# Altium schematic sheet OX05B1S_CAM0.SchDoc: =ProjectTitle
size A3; SheetNumber: 15; SheetTotal: 19
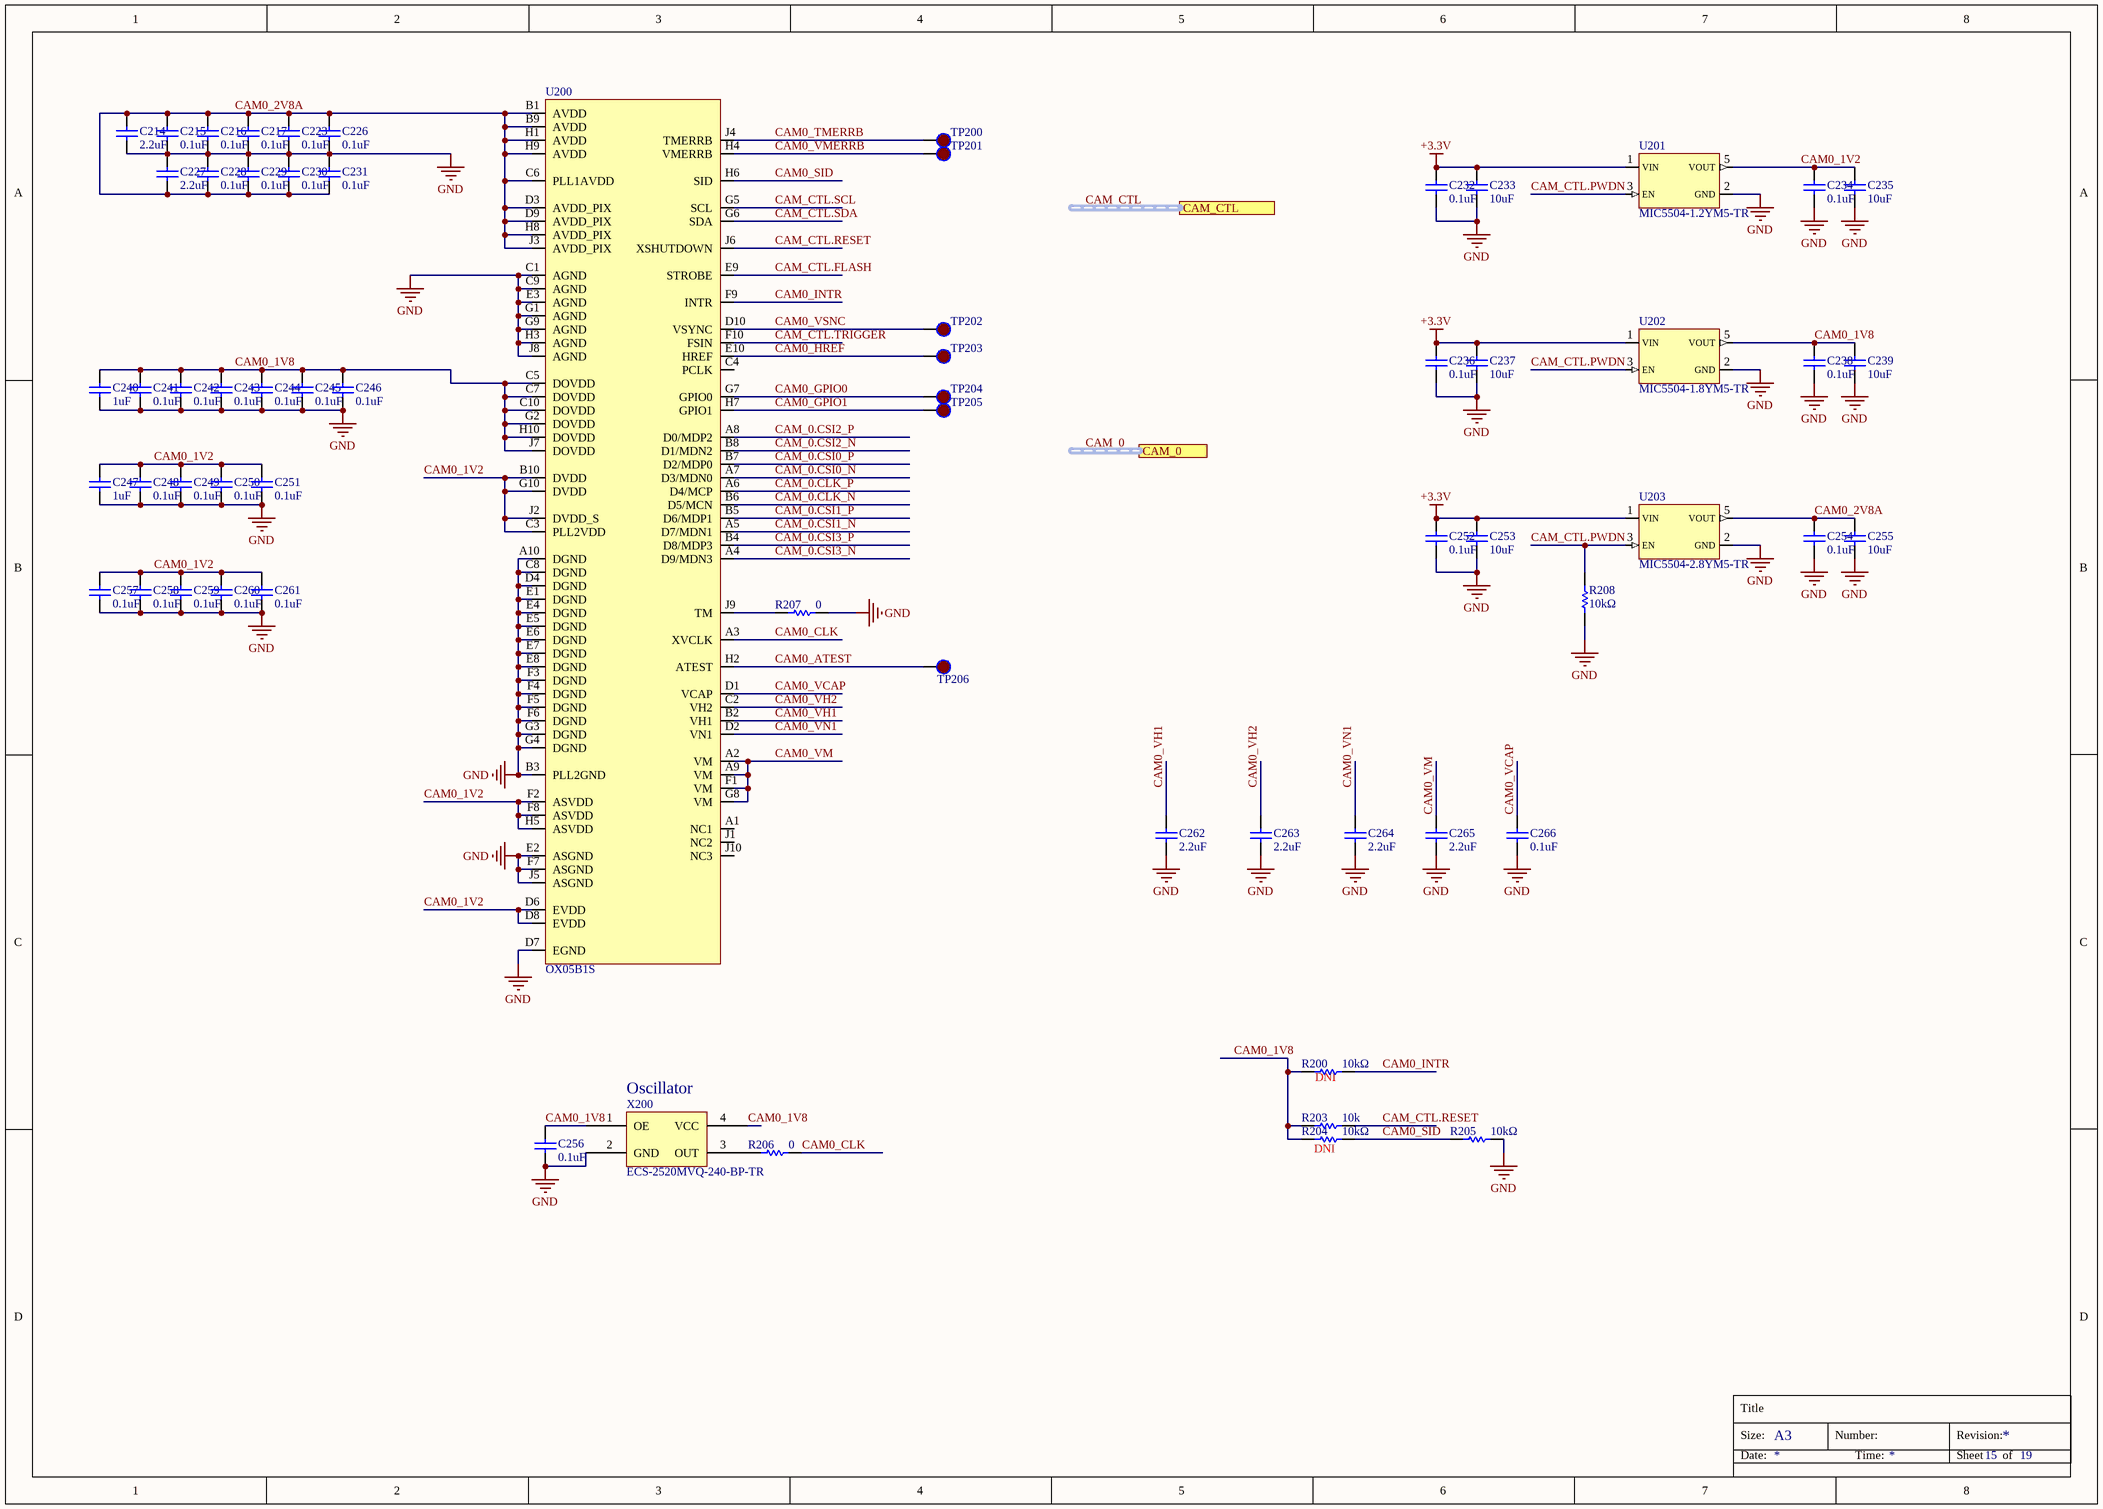
[diagram p0: OX05B1S_CAM0.SchDoc]

## Parts
C214  2.2uF  [0402_CAP_NP]
C215  0.1uF  [0402_CAP_NP]
C216  0.1uF  [0402_CAP_NP]
C217  0.1uF  [0402_CAP_NP]
C223  0.1uF  [0402_CAP_NP]
C226  0.1uF  [0402_CAP_NP]
C227  2.2uF  [0402_CAP_NP]
C228  0.1uF  [0402_CAP_NP]
C229  0.1uF  [0402_CAP_NP]
C230  0.1uF  [0402_CAP_NP]
C231  0.1uF  [0402_CAP_NP]
C232  0.1uF  [0402_CAP_NP]
C233  10uF  [0603_CAP_NP]
C234  0.1uF  [0402_CAP_NP]
C235  10uF  [0603_CAP_NP]
C236  0.1uF  [0402_CAP_NP]
C237  10uF  [0603_CAP_NP]
C238  0.1uF  [0402_CAP_NP]
C239  10uF  [0603_CAP_NP]
C240  1uF  [0402_CAP_NP]
C241  0.1uF  [0402_CAP_NP]
C242  0.1uF  [0402_CAP_NP]
C243  0.1uF  [0402_CAP_NP]
C244  0.1uF  [0402_CAP_NP]
C245  0.1uF  [0402_CAP_NP]
C246  0.1uF  [0402_CAP_NP]
C247  1uF  [0402_CAP_NP]
C248  0.1uF  [0402_CAP_NP]
C249  0.1uF  [0402_CAP_NP]
C250  0.1uF  [0402_CAP_NP]
C251  0.1uF  [0402_CAP_NP]
C252  0.1uF  [0402_CAP_NP]
C253  10uF  [0603_CAP_NP]
C254  0.1uF  [0402_CAP_NP]
C255  10uF  [0603_CAP_NP]
C256  0.1uF  [0402_CAP_NP]
C257  0.1uF  [0402_CAP_NP]
C258  0.1uF  [0402_CAP_NP]
C259  0.1uF  [0402_CAP_NP]
C260  0.1uF  [0402_CAP_NP]
C261  0.1uF  [0402_CAP_NP]
C262  2.2uF  [0402_CAP_NP]
C263  2.2uF  [0402_CAP_NP]
C264  2.2uF  [0402_CAP_NP]
C265  2.2uF  [0402_CAP_NP]
C266  0.1uF  [0402_CAP_NP]
R200  value 10kΩ  Populate: DNI  [0603_RES]  (hidden comment: 10k)
R203  10k  [0402_RES]
R204  value 10kΩ  Populate: DNI  [0603_RES]  (hidden comment: 10k)
R205  value 10kΩ  [0603_RES]  (hidden comment: 10k)
R206  0  [0603_RES]
R207  0  [0603_RES]
R208  value 10kΩ  [0603_RES]  (hidden comment: 10k)
TP200  TestPoint_1mm_SM  [TESTPAD_1mm]  (value not drawn)  (no BOM)
TP201  TestPoint_1mm_SM  [TESTPAD_1mm]  (value not drawn)  (no BOM)
TP202  TestPoint_1mm_SM  [TESTPAD_1mm]  (value not drawn)  (no BOM)
TP203  TestPoint_1mm_SM  [TESTPAD_1mm]  (value not drawn)  (no BOM)
TP204  TestPoint_1mm_SM  [TESTPAD_1mm]  (value not drawn)  (no BOM)
TP205  TestPoint_1mm_SM  [TESTPAD_1mm]  (value not drawn)  (no BOM)
TP206  TestPoint_1mm_SM  [TESTPIN_1mm]  (value not drawn)  (no BOM)
U200  OX05B1S  [BGA_OX05B1S]
U201  MIC5504-1.2YM5-TR  [SOT23-5]
U202  MIC5504-1.8YM5-TR  [SOT23-5]
U203  MIC5504-2.8YM5-TR  [SOT23-5]
X200  ECS-2520MVQ-240-BP-TR  [Active Oscillator 2520]

## Ports
CAM_0 (harness MIPI), CAM_CTL (harness CAM_CTL)

## Nets
+3.3V: C232.2 C233.2 C236.2 C237.2 C252.2 C253.2 U201.1(VIN) U202.1(VIN) U203.1(VIN)
GND: C214.1 C215.1 C216.1 C217.1 C223.1 C226.1 C227.2 C228.2 C229.2 C230.2 C231.2 C232.1 C233.1 C234.1 C235.1 C236.1 C237.1 C238.1 C239.1 C240.1 C241.1 C242.1 C243.1 C244.1 C245.1 C246.1 C247.1 C248.1 C249.1 C250.1 C251.1 C252.1 C253.1 C254.1 C255.1 C256.1 C257.1 C258.1 C259.1 C260.1 C261.1 C262.1 C263.1 C264.1 C265.1 C266.1 R205.1 R207.2 R208.2 U200.A10(DGND) U200.B3(PLL2GND) U200.C1(AGND) U200.C8(DGND) U200.C9(AGND) U200.D4(DGND) U200.D7(EGND) U200.E1(DGND) U200.E2(ASGND) U200.E3(AGND) U200.E4(DGND) U200.E5(DGND) U200.E6(DGND) U200.E7(DGND) U200.E8(DGND) U200.F3(DGND) U200.F4(DGND) U200.F5(DGND) U200.F6(DGND) U200.F7(ASGND) U200.G1(AGND) U200.G3(DGND) U200.G4(DGND) U200.G9(AGND) U200.H3(AGND) U200.J5(ASGND) U200.J8(AGND) U201.2(GND) U202.2(GND) U203.2(GND) X200.2(GND)
CAM0_1V2: C234.2 C235.2 C247.2 C248.2 C249.2 C250.2 C251.2 C257.2 C258.2 C259.2 C260.2 C261.2 U200.B10(DVDD) U200.C3(PLL2VDD) U200.D6(EVDD) U200.D8(EVDD) U200.F2(ASVDD) U200.F8(ASVDD) U200.G10(DVDD) U200.H5(ASVDD) U200.J2(DVDD_S) U201.5(VOUT)
CAM0_1V8: C238.2 C239.2 C240.2 C241.2 C242.2 C243.2 C244.2 C245.2 C246.2 C256.2 R200.2 R203.2 R204.2 U200.C5(DOVDD) U200.C7(DOVDD) U200.C10(DOVDD) U200.G2(DOVDD) U200.H10(DOVDD) U200.J7(DOVDD) U202.5(VOUT) X200.1(OE) X200.4(VCC)
CAM0_2V8A: C214.2 C215.2 C216.2 C217.2 C223.2 C226.2 C227.1 C228.1 C229.1 C230.1 C231.1 C254.2 C255.2 U200.B1(AVDD) U200.B9(AVDD) U200.C6(PLL1AVDD) U200.D3(AVDD_PIX) U200.D9(AVDD_PIX) U200.H1(AVDD) U200.H8(AVDD_PIX) U200.H9(AVDD) U200.J3(AVDD_PIX) U203.5(VOUT)
CAM0_ATEST: TP206.1 U200.H2(ATEST)
CAM0_CLK: R206.2 U200.A3(XVCLK)
CAM0_GPIO0: TP204.1 U200.G7(GPIO0)
CAM0_GPIO1: TP205.1 U200.H7(GPIO1)
CAM0_HREF: TP203.1 U200.E10(HREF)
CAM0_INTR: R200.1 U200.F9(INTR)
CAM0_SID: R204.1 R205.2 U200.H6(SID)
CAM0_TMERRB: TP200.1 U200.J4(TMERRB)
CAM0_VCAP: C266.2 U200.D1(VCAP)
CAM0_VH1: C262.2 U200.B2(VH1)
CAM0_VH2: C263.2 U200.C2(VH2)
CAM0_VM: C265.2 U200.A2(VM) U200.A9(VM) U200.F1(VM) U200.G8(VM)
CAM0_VMERRB: TP201.1 U200.H4(VMERRB)
CAM0_VN1: C264.2 U200.D2(VN1)
CAM0_VSNC: TP202.1 U200.D10(VSYNC)
CAM_0.CLK_N: U200.B6(D5/MCN)
CAM_0.CLK_P: U200.A6(D4/MCP)
CAM_0.CSI0_N: U200.A7(D3/MDN0)
CAM_0.CSI0_P: U200.B7(D2/MDP0)
CAM_0.CSI1_N: U200.A5(D7/MDN1)
CAM_0.CSI1_P: U200.B5(D6/MDP1)
CAM_0.CSI2_N: U200.B8(D1/MDN2)
CAM_0.CSI2_P: U200.A8(D0/MDP2)
CAM_0.CSI3_N: U200.A4(D9/MDN3)
CAM_0.CSI3_P: U200.B4(D8/MDP3)
CAM_CTL.FLASH: U200.E9(STROBE)
CAM_CTL.PWDN: R208.1 U201.3(EN) U202.3(EN) U203.3(EN)
CAM_CTL.RESET: R203.1 U200.J6(XSHUTDOWN)
CAM_CTL.SCL: U200.G5(SCL)
CAM_CTL.SDA: U200.G6(SDA)
CAM_CTL.TRIGGER: U200.F10(FSIN)
NetR206_1: R206.1 X200.3(OUT)
NetR207_1: R207.1 U200.J9(TM)

Not connected (* = marked no-connect by the designer): U200 A1(NC1) C4(PCLK) J1(NC2) J10(NC3)

## Buses and harness runs
harness CAM_0 = port CAM_0
harness CAM_CTL = port CAM_CTL

## Notes on the sheet
- (near X200) Oscillator
- Title
- Size:
- Date:
- A3
- Number:
- Time:
- Revision:
- Sheet
- of

## Library data of the parts
C214 C227 C262-C265 = 0402C_2.2UF_6.3V_10%_X5R: CAP CER 2.2UF 6.3V X5R ±10% 0402; Manufacturer: Murata; Manufacturer Part Number: GRM155R60J225KE95D; Unit Cost, Qty 1: $0.13; Unit Cost, Qty 500: $0.03126; Value: 2.2uF
C215-C217 C223 C226 C228-C232 C234 C236 C238 C241-C246 C248-C252 C254 C256-C261 C266 = 0402C_0.1UF_25V_10%_X7R: CAP CER 0.1UF 25V X7R 0402; Manufacturer: AVX; Manufacturer Part Number: 04023C104KAT2A; Unit Cost, Qty 1: $0.12; Unit Cost, Qty 500: $0.02758; Value: 0.1uF
C233 C235 C237 C239 C253 C255 = 0603C_10UF_10V_20%_X5R: CAP CER 10UF 10V X5R 0603; Manufacturer: Taiyo Yuden; Manufacturer Part Number: LMK107BBJ106MALT; Component Description: 10 µF ±20% 10V Ceramic Capacitor X5R 0603; Unit Cost, Qty 1: $0.18; Unit Cost, Qty 500: 0.04188; Value: 10uF
C240 C247 = 0402C_1UF_16V_10%_X5R: CAP CER 1UF 16V X5R 0402 ±10%; Manufacturer: Taiyo Yuden; Manufacturer Part Number: EMK105BJ105KV-F; Unit Cost, Qty 1: $0.14; Unit Cost, Qty 500: $0.034; Value: 1uF
R200 R204 R205 R208 = 0603R_10k_1%_0.1W: RES SMD 10K OHM 1% 1/10W 0603; Manufacturer: Yageo; Manufacturer Part Number: RC0603FR-0710KL; Component Description: Resistor 10k Ohm ±1% 0.1W 0603; Unit Cost, Qty 1: $0.10; Unit Cost, Qty 500: $0.00316
R203 = 0402R_10k_1%_0.063W: RES SMD 10K OHM 1% 1/16W 0402; Manufacturer: Yageo; Manufacturer Part Number: RC0402FR-0710KL
R206 = 0603R_0_0.1W: Resistor 0 ohm 0.1W 0603; MPN: RC0603JR-070RL; Mfg: Yageo; Unit Cost, Qty 1: $0.10; Unit Cost, Qty 500: $0.002252; Value: 0
R207 = 0603R_0_0.1W: Resistor 0 ohm 0.1W 0603; Manufacturer: Yageo; Manufacturer Part Number: RC0603JR-070RL; Unit Cost, Qty 1: $0.10; Unit Cost, Qty 500: $0.002252; Value: 0
TP200-TP206 = TestPoint_1mm_SM: Populate: DNP
U200 = OX05B1S: 1/2.53" CMOS 5MP image sensor; Manufacturer: OMNIVISION; Manufacturer Part Number: OX05B1S
U201 = MIC550x: IC REG LINEAR 1.2V 300MA SOT23-5; Manufacturer: Microchip; Dropout Voltage: 160mV; Number of Regulators: 1; Min Current Limit: 400mA; Supplier 1: Digikey; Supplier Part Number 1: 576-4878-1-ND; Manufacturer Part Number: MIC5504-1.2YM5-TR; RoHS: Yes; Category: Voltage Regulators - Linear; Stock 1: 9823; Pricing 1: 1=0.16000, 25=0.12000, 100=0.11000 (USD); Mount: Surface Mount; Case/Package: SOT-23-5; Min Operating Temperature: -40°C; Max Operating Temperature: 125°C; Packaging: Cut Tape; Output Voltage: 1.2V; Output Current: 300mA; Series: -; RoHS Compliant: Yes; ComponentLink1URL: http://www.microchip.com/mymicrochip/filehandler.aspx?ddocname=en580292&src-supplier=Digikey; ComponentLink1Description: http://www.microchip.com/mymicrochip/filehandler.aspx?ddocname=en580292&src-supplier=Digikey; ComponentLink2URL: https://datasheet.octopart.com/MIC5504-1.2YM5-TR-Microchip-datasheet-137404938.pdf?src-supplier=Future+Electronics; ComponentLink2Description: https://datasheet.octopart.com/MIC5504-1.2YM5-TR-Microchip-datasheet-137404938.pdf?src-supplier=Future+Electronics; ComponentLink3URL: https://datasheet.octopart.com/MIC5504-1.2YM5-TR-Microchip-datasheet-137453438.pdf?src-supplier=Master+Electronics; ComponentLink3Description: https://datasheet.octopart.com/MIC5504-1.2YM5-TR-Microchip-datasheet-137453438.pdf?src-supplier=Master+Electronics
U202 = MIC550x: Linear Voltage Regulator IC Positive Fixed 1 Output 1.8V 300mA SOT-23-5; Manufacturer: Microchip; Dropout Voltage: 160mV; Number of Regulators: 1; Min Current Limit: 400mA; Supplier 1: Digikey; Supplier Part Number 1: 576-4879-1-ND; Manufacturer Part Number: MIC5504-1.8YM5-TR; RoHS: Yes; Category: Voltage Regulators - Linear; Stock 1: 307926; Pricing 1: 1=0.16000, 25=0.12000, 100=0.11000 (USD); Mount: Surface Mount; Case/Package: SOT-23-5; Min Operating Temperature: -40°C; Max Operating Temperature: 125°C; Packaging: Cut Tape; Series: -; Output Voltage: 1.8V; Output Current: 300mA; RoHS Compliant: Yes
U203 = MIC550x: LDO Fixed Output Voltage Regulator MIC5504-2.8YM5-TR, 2.8V, 300mA, SOT23-5 /tape-3k/; Manufacturer: Microchip; Dropout Voltage: 160mV; Number of Regulators: 1; Min Current Limit: 400mA; Min Input Voltage: 2.5V; Max Input Voltage: 5.5V; Operating Supply Current: 42uA; Power Supply Rejection Ratio (PSRR): 60dB; Quiescent Current: 35uA; Accuracy: 3%; Supplier 1: Digikey; Supplier Part Number 1: 576-4763-1-ND; Manufacturer Part Number: MIC5504-2.8YM5-TR; RoHS: Yes; Category: Voltage Regulators - Linear; Stock 1: 39893; Pricing 1: 1=0.16000, 25=0.12000, 100=0.11000 (USD); Mount: Surface Mount; Case/Package: SOT-23-5; Number of Pins: 5; Min Operating Temperature: -40°C; Max Operating Temperature: 125°C; Packaging: Tape and Reel; Output Voltage: 2.8V; Output Current: 300mA; Nominal Output Voltage: 2.8V; Output Type: Fixed; Series: -; Number of Outputs: 1; Max Output Current: 300mA; Length: 2.9mm; Width: 1.6mm; Height: 1.1mm; Reach SVHC Compliant: No; ComponentLink1URL: https://datasheet.ciiva.com/46425/1856860-46425638.pdf?src-supplier=Element14; ComponentLink1Description: https://datasheet.ciiva.com/46425/1856860-46425638.pdf?src-supplier=Element14
X200 = Oscillator_2520: Oscillator XO 24MHz ±50ppm 15pF HCMOS 55% 1.8V/2.5V/3.3V Automotive 4-Pin Mini-CSMD T/R; Manufacturer: ECS International; Max Supply Current: 10mA; Supplier 1: Digikey; Supplier Part Number 1: 50-ECS-2520MVQ-240-BP-CT-ND; Manufacturer Part Number: ECS-2520MVQ-240-BP-TR; RoHS: Yes; Category: Oscillators; Stock 1: 12794; Pricing 1: 1=1.15000, 10=1.09900, 50=1.07380, 100=0.92040, 500=0.89484 (USD); Mount: Surface Mount; Case/Package: SMD/SMT; Min Operating Temperature: -40°C; Max Operating Temperature: 105°C; Series: MultiVolt™ ECS-2520MVQ; Frequency Stability: 50ppm; Frequency: 24MHz; Ratings: AEC-Q200; RoHS Compliant: Yes